# Altium schematic sheet test_connector.SchDoc: Test Connector
size A4; Author: Lucas Liaño; Revision: 1; SheetNumber: 8; SheetTotal: 8
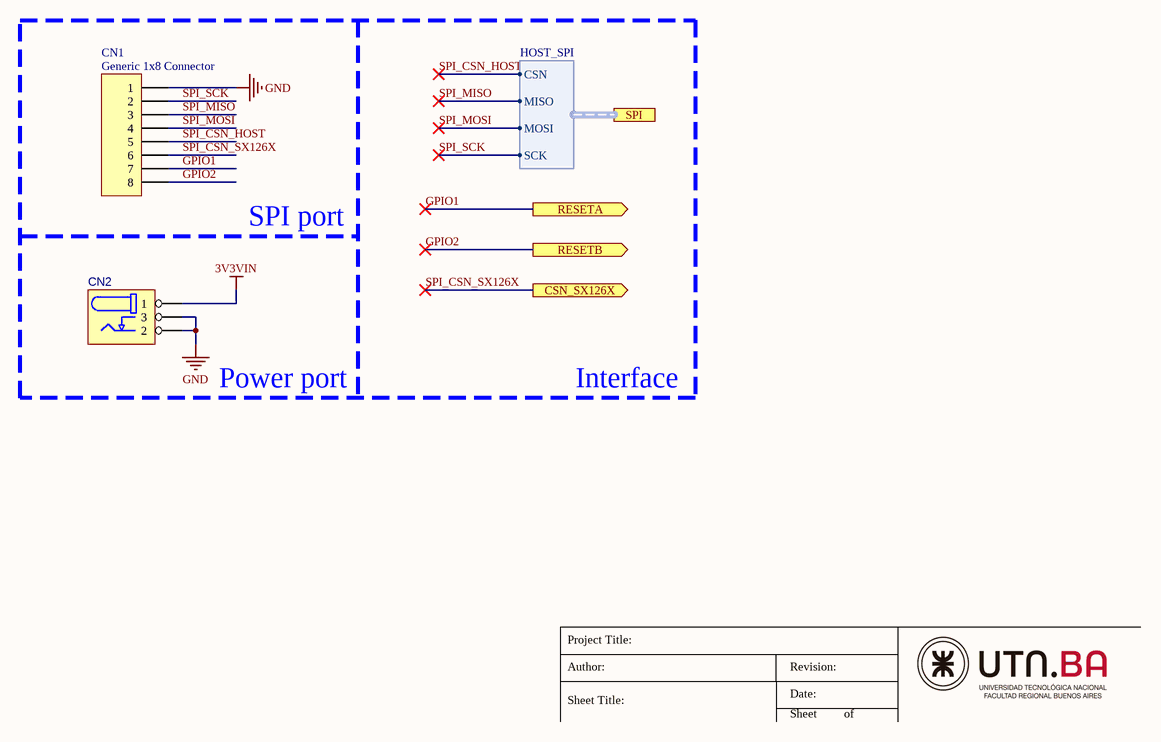
[diagram p0: test_connector.SchDoc]

## Parts
CN1  Generic 1x8 Connector  [Header_M_1x8_0.1"]
CN2  Barrel Power Connector  [PJ002B]  (value not drawn)

## Ports
CSN_SX126X (out), RESETA (out), RESETB (out), SPI (harness HOST_SPI)

## Harnesses
HOST_SPI: CSN, MISO, MOSI, SCK

## Nets
3V3VIN: CN2.1
GND: CN1.1 CN2.2 CN2.3
GPIO1: CN1.7 ; port RESETA
GPIO2: CN1.8 ; port RESETB
SPI_CSN_HOST: CN1.5 ; port SPI.CSN
SPI_CSN_SX126X: CN1.6 ; port CSN_SX126X
SPI_MISO: CN1.3 ; port SPI.MISO
SPI_MOSI: CN1.4 ; port SPI.MOSI
SPI_SCK: CN1.2 ; port SPI.SCK

## Notes on the sheet
- SPI port
- Power port
- Interface
- Project Title:
- Author:
- Sheet Title:
- Date:
- Revision:
- Sheet
- of

## Library data of the parts
CN1 = CONN_8P: Connector Generic 8 Vias; Manufacturer: Oupiin; MPN: 2011-1X08G00SB; Value: Connector Generic 8 positions; ComponentLink1Description: Datasheet; ComponentLink1URL: https://www.digikey.com/es/products/detail/oupiin/2011-1X08G00SB/13251999; ComponentLink2Description: SupplierLink; ComponentLink2URL: https://www.digikey.com/es/products/detail/oupiin/2011-1X08G00SB/13251999; Package: Connector; Price (USD): 0.15; Supplier: Digikey
CN2 = CN_PowerJack: CONN PWR JACK 2.5X5.5MM SOLDER; Manufacturer: CUI Devices; MPN: PJ-002B; ComponentLink1Description: Datasheet; ComponentLink2Description: SupplierLink; ComponentLink2URL: https://www.digikey.com/en/products/detail/cui-devices/PJ-002B/96965; Package: Barrel jack connector; Price (USD): 0.71; Supplier: Digikey; Value: CONN PWR JACK 2.5X5.5MM SOLDER